# Altium project MCU Rat.PrjPcb
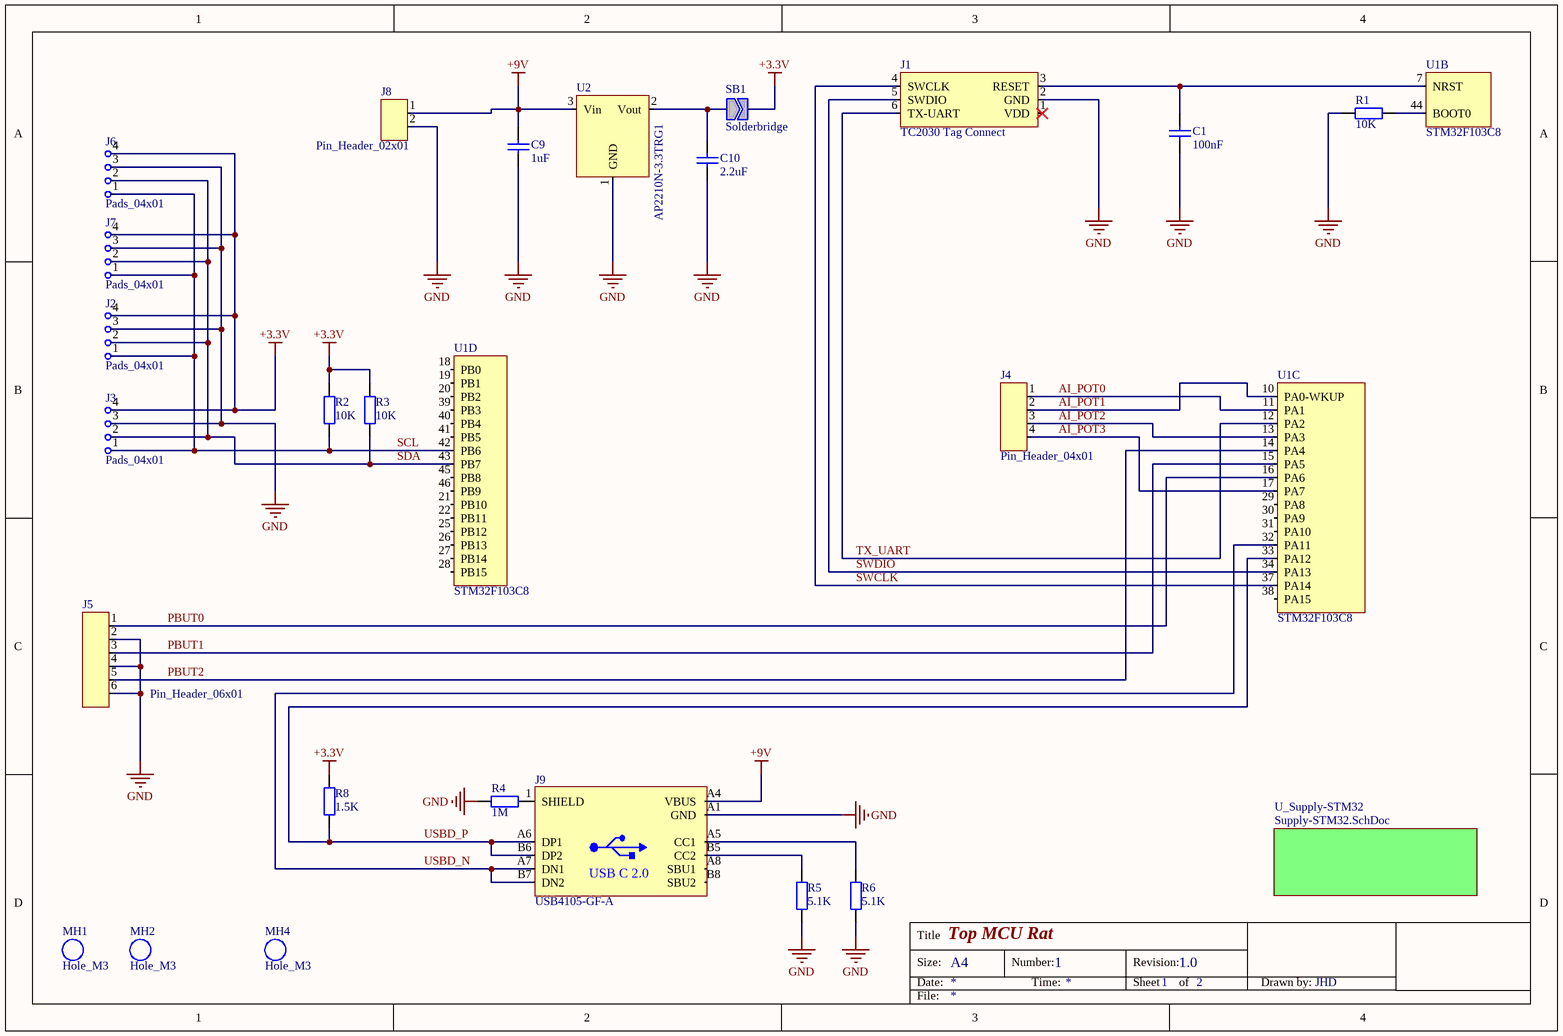
[diagram p0: Top.SchDoc]
2 sheets, 36 parts. Net scope: global (net labels, ports and power ports of the same name join across sheets).
Board file: MCU Rat.PcbDoc
Sheets:
  Top.SchDoc
    U_Supply-STM32 = Supply-STM32.SchDoc

## Sheet Top.SchDoc: Top MCU Rat
size A4; DrawnBy: JHD; DocumentNumber: 1; Revision: 1.0; SheetNumber: 1; SheetTotal: 2

### Parts
C1  value 100nF  [CAP_0603]  (hidden comment: CAP)
C9  value 1uF  [CAP_0603]  (hidden comment: CAP)
C10  value 2.2uF  [CAP_0603]  (hidden comment: CAP)
J1  TC2030 Tag Connect  [TC2030-MCP]
J2  Pads_04x01  [04X01_PADS_2.54MM]
J3  Pads_04x01  [04X01_PADS_2.54MM]
J4  Pin_Header_04x01  [04x01_Header_2.54mm_MAL]
J5  Pin_Header_06x01  [06X01_TERM_5.00MM_FEM_DOWN]
J6  Pads_04x01  [04X01_PADS_2.54MM]
J7  Pads_04x01  [04X01_PADS_2.54MM]
J8  Pin_Header_02x01  [02X01_TERM_5.00MM_FEM_DOWN]
J9  USB4105-GF-A  [USB4105-GF-A]
MH1  Hole_M3  [Hole_M3]
MH2  Hole_M3  [Hole_M3]
MH4  Hole_M3  [Hole_M3]
R1  value 10K  [RES_0603]  (hidden comment: RES)
R2  value 10K  [RES_0603]  (hidden comment: RES)
R3  value 10K  [RES_0603]  (hidden comment: RES)
R4  value 1M  [RES_0603]  (hidden comment: RES)
R5  value 5.1K  [RES_0603]  (hidden comment: RES)
R6  value 5.1K  [RES_0603]  (hidden comment: RES)
R8  value 1.5K  [RES_0603]  (hidden comment: RES)
SB1  Solderbridge  [TRIAN SOLDERBRIDGE]
U1  STM32F103C8  [LQFP48P05S97X97]  (parts B,C,D of 6)
U2  AP2210N-3.3TRG1  [SOT-23-3]

### Sub-sheets
U_Supply-STM32 = Supply-STM32.SchDoc: no entries

### Nets
+3.3V: J2.4 J3.4 J6.4 J7.4 R2.2 R3.2 R8.2 SB1.2
+9V: C9.2 J8.1 J9.A4(VBUS) U2.3(Vin)
GND: C1.1 C9.1 C10.1 J1.2(GND) J2.3 J3.3 J5.2 J5.4 J5.6 J6.3 J7.3 J8.2 J9.A1(GND) R1.2 R4.2 R5.1 R6.1 U2.1(GND)
AI_POT0: J4.1 U1.11(PA1)
AI_POT1: J4.2 U1.10(PA0-WKUP)
AI_POT2: J4.3 U1.13(PA3)
AI_POT3: J4.4 U1.17(PA7)
PBUT0: J5.1 U1.16(PA6)
PBUT1: J5.3 U1.15(PA5)
PBUT2: J5.5 U1.14(PA4)
SCL: J2.1 J3.1 J6.1 J7.1 R2.1 U1.42(PB6)
SDA: J2.2 J3.2 J6.2 J7.2 R3.1 U1.43(PB7)
SWCLK: J1.4(SWCLK) U1.37(PA14)
SWDIO: J1.5(SWDIO) U1.34(PA13)
TX_UART: J1.6(TX-UART) U1.12(PA2)
USBD_N: J9.A7(DN1) J9.B7(DN2) U1.32(PA11)
USBD_P: J9.A6(DP1) J9.B6(DP2) R8.1 U1.33(PA12)
NetC1_2: C1.2 J1.3(RESET) U1.7(NRST)
NetC10_2: C10.2 SB1.1 U2.2(Vout)
NetJ9_1: J9.1(SHIELD) R4.1
NetJ9_A5: J9.A5(CC1) R6.2
NetJ9_B5: J9.B5(CC2) R5.2
NetR1_1: R1.1 U1.44(BOOT0)

Not connected (* = marked no-connect by the designer): J1 1(VDD)*; J9 A8(SBU1) B8(SBU2); U1 18(PB0) 19(PB1) 20(PB2) 21(PB10) 22(PB11) 25(PB12) 26(PB13) 27(PB14) 28(PB15) 29(PA8) 30(PA9) 31(PA10) 38(PA15) 39(PB3) 40(PB4) 41(PB5) 45(PB8) 46(PB9)

### Notes on the sheet
- Title
- Size:
- Date:
- A4
- Number:
- Time:
- Revision:
- Sheet
- of
- Drawn by:
- File:
- (in symbol USB4105-GF-A) USB C 2.0

### Library data of the parts
J1 = TC2030
J9 = USB4105-GF-A: USB Connectors USB Type C,2.0, Rec,SMT, 0.95mmTH Shell Stakes,G/F,RA,Top Mnt,T&R; Distributor: Mouser; Manufacturer: *; Manufacturer Number: USB4105-GF-A; Distributor Number: 640-USB4105-GF-A
R1 = RES: Manufacturer Number: HV731JRTTD1002F; Distributor Number: 660-HV731JRTTD1002F; Distributor: Mouser; Manufacturer: *
R4 = RES: Manufacturer Number: CHV1206-JW-105EST; Manufacturer: *; Distributor: Mouser; Distributor Number: 652-CHV1206JW105EST
R5 R6 = RES: Manufacturer Number: SDR03EZPF5101; Manufacturer: *; Distributor: Mouser; Distributor Number: 755-SDR03EZPF5101
U2 = AP2210N-3.3TRG1: The AP2210 is a 300mA ULDO regulator which provides very low / noise, ultra-low dropout voltage (typically 250mV at 300mA), very low standby current (1µA maximum), and excellent power supply ripple rejection (PSRR 75dB at 100Hz). This device is used in battery powered applications, such as handsets and PDAs; and in noise sensitive applications, such as RF electronics; Manufacturer: Diodes Incorperated; Distributor: Mouser; Manufacturer Number: AP2210N-3.3TRG1; Distributor Number: 621-AP2210N-3.3TRG1
C1 C9 C10 = CAP
  C9 C10: Manufacturer Number: *; Manufacturer: *; Distributor: *; Distributor Number: *
J8 = Pin_Header_02x01: Manufacturer Number: *; Manufacturer: *; Distributor: *; Distributor Number: *
MH1 MH2 MH4 = Hole_M3: Manufacturer Number: *
R2 R3 R8 = RES: Manufacturer Number: *; Manufacturer: *; Distributor: *; Distributor Number: *

## Sheet Supply-STM32.SchDoc
size A4; SheetNumber: 2; SheetTotal: 2
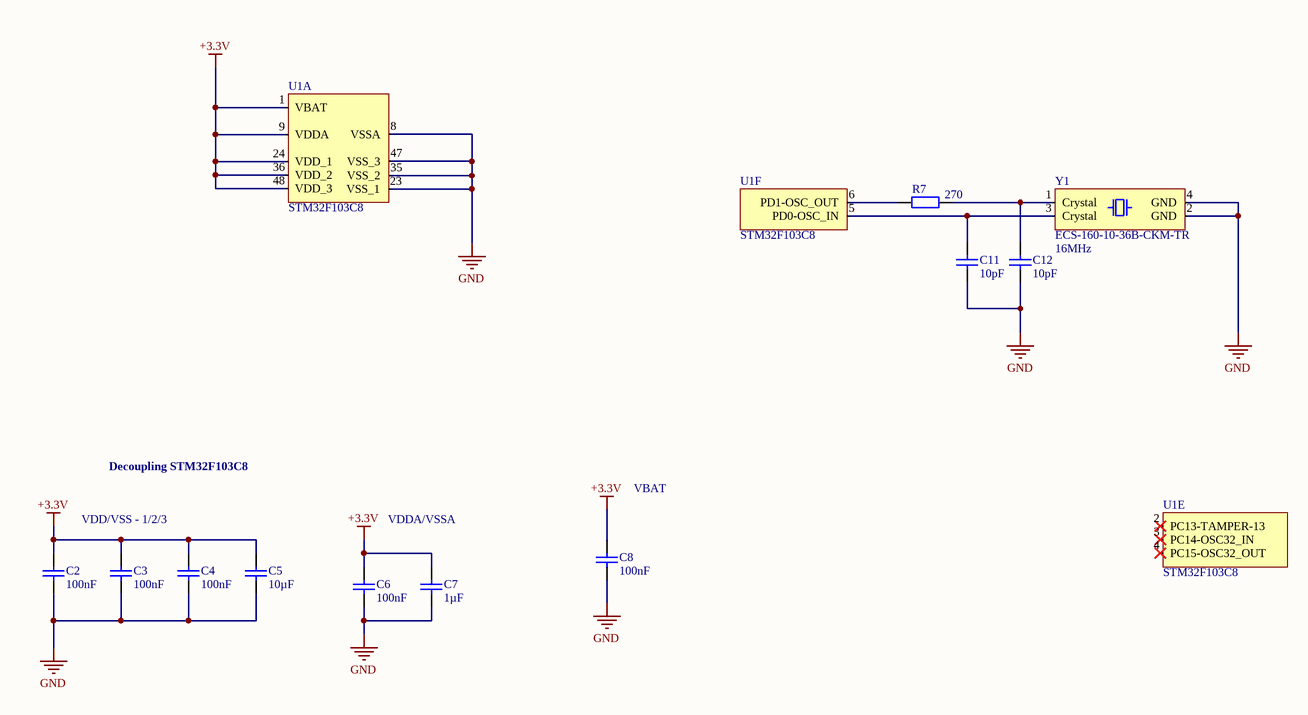
[diagram p1: Supply-STM32.SchDoc]

### Parts
C2  value 100nF  [CAP_0603]  (hidden comment: CAP)
C3  value 100nF  [CAP_0603]  (hidden comment: CAP)
C4  value 100nF  [CAP_0603]  (hidden comment: CAP)
C5  value 10µF  [CAP_0603]  (hidden comment: CAP)
C6  value 100nF  [CAP_0603]  (hidden comment: CAP)
C7  value 1µF  [CAP_0603]  (hidden comment: CAP)
C8  value 100nF  [CAP_0603]  (hidden comment: CAP)
C11  value 10pF  [CAP_0603]  (hidden comment: CAP)
C12  value 10pF  [CAP_0603]  (hidden comment: CAP)
R7  value 270  [RES_0603]  (hidden comment: RES)
U1  STM32F103C8  [LQFP48P05S97X97]  (parts A,E,F of 6)
Y1  ECS-160-10-36B-CKM-TR  Parameter 1: 16MHz  [Crystal_16MHz]

### Nets
+3.3V: C2.2 C3.2 C4.2 C5.2 C6.2 C7.2 C8.2 U1.1(VBAT) U1.9(VDDA) U1.24(VDD_1) U1.36(VDD_2) U1.48(VDD_3)
GND: C2.1 C3.1 C4.1 C5.1 C6.1 C7.1 C8.1 C11.1 C12.1 U1.8(VSSA) U1.23(VSS_1) U1.35(VSS_2) U1.47(VSS_3) Y1.2(GND) Y1.4(GND)
NetC11_2: C11.2 U1.5(PD0-OSC_IN) Y1.3(Crystal)
NetC12_2: C12.2 R7.1 Y1.1(Crystal)
NetR7_2: R7.2 U1.6(PD1-OSC_OUT)

Not connected (* = marked no-connect by the designer): U1 2(PC13-TAMPER-13)* 3(PC14-OSC32_IN)* 4(PC15-OSC32_OUT)*

### Notes on the sheet
- Decoupling STM32F103C8
- VDD/VSS - 1/2/3
- VDDA/VSSA
- VBAT
- Title
- Size:
- Date:
- A4
- Number:
- Time:
- Revision:
- Sheet
- of
- Drawn by:
- File:

### Library data of the parts
C2-C8 C11 C12 = CAP
  C8 C11 C12: Manufacturer Number: *; Manufacturer: *; Distributor: *; Distributor Number: *
R7 = RES: Manufacturer Number: *; Manufacturer: *; Distributor: *; Distributor Number: *

## Nets that join several sheets
+3.3V: Top (8 pins), Supply-STM32 (12 pins)
GND: Top (18 pins), Supply-STM32 (15 pins)